# Altium schematic sheet StepperMotorBoard.SchDoc
size A3
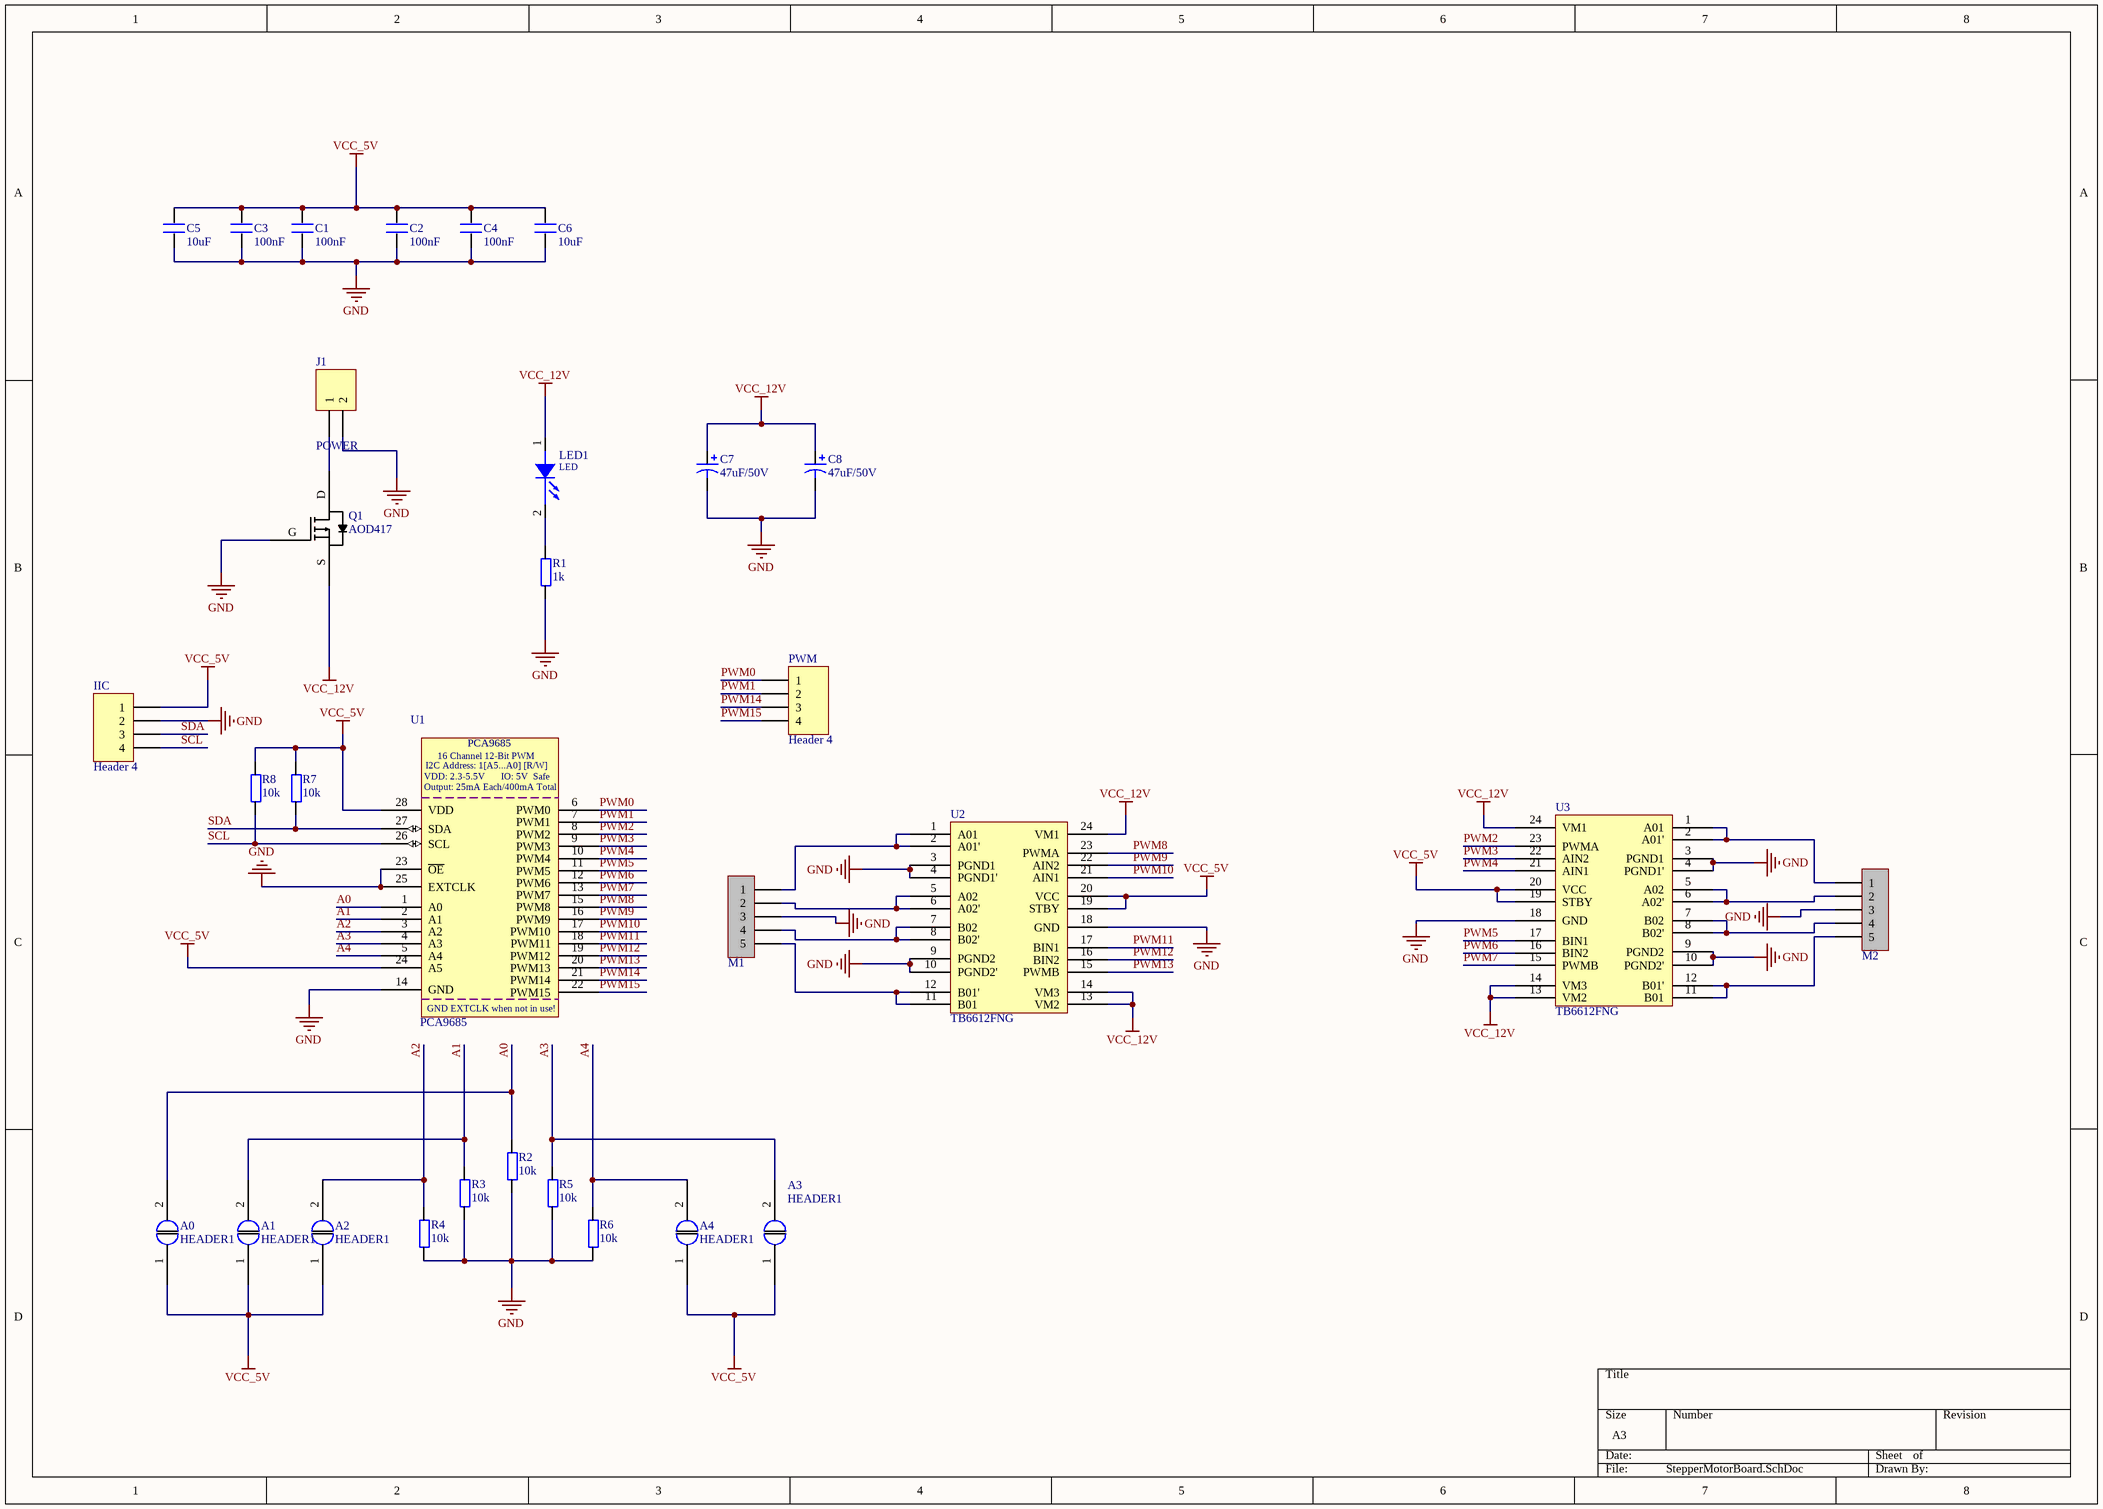
[diagram p0: StepperMotorBoard.SchDoc]

## Parts
A0  HEADER1  [HEADER1]
A1  HEADER1  [HEADER1]
A2  HEADER1  [HEADER1]
A3  HEADER1  [HEADER1]
A4  HEADER1  [HEADER1]
C1  100nF  [0603]
C2  100nF  [0603]
C3  100nF  [0603]
C4  100nF  [0603]
C5  10uF  [0603]
C6  10uF  [0603]
C7  47uF/50V  [SMDEC-6MM(220MIL)]
C8  47uF/50V  [SMDEC-6MM(220MIL)]
IIC  Header 4  [2.54-4]
J1  POWER  [Terminal block ED655]
LED1  LED  [SMDLED-0603]
M1  CON5_1  [2.54-5PMR]  (value not drawn)
M2  CON5_1  [2.54-5PMR]  (value not drawn)
PWM  Header 4  [2.54-4]
Q1  AOD417  [TO-252]
R1  1k  [0603P]
R2  10k  [0603P]
R3  10k  [0603P]
R4  10k  [0603P]
R5  10k  [0603P]
R6  10k  [0603P]
R7  10k  [0603P]
R8  10k  [0603P]
U1  PCA9685  [TSOP65P640X110-28N]
U2  TB6612FNG  [SSOP65P760X160-24N]
U3  TB6612FNG  [SSOP65P760X160-24N]

## Nets
GND: C1.2 C2.2 C3.2 C4.2 C5.2 C6.2 C7.2 C8.2 IIC.2 J1.2 M1.3 M2.3 Q1.G R1.1 R2.1 R3.1 R4.1 R5.1 R6.1 U1.14(GND) U1.23(~{OE}) U1.25(EXTCLK) U2.3(PGND1) U2.4(PGND1') U2.9(PGND2) U2.10(PGND2') U2.18(GND) U3.3(PGND1) U3.4(PGND1') U3.9(PGND2) U3.10(PGND2') U3.18(GND)
VCC_5V: A0.1 A1.1 A2.1 A3.1 A4.1 C1.1 C2.1 C3.1 C4.1 C5.1 C6.1 IIC.1 R7.2 R8.2 U1.24(A5) U1.28(VDD) U2.19(STBY) U2.20(VCC) U3.19(STBY) U3.20(VCC)
VCC_12V: C7.1 C8.1 LED1.1(ANODE) Q1.S U2.13(VM2) U2.14(VM3) U2.24(VM1) U3.13(VM2) U3.14(VM3) U3.24(VM1)
A0: A0.2 R2.2 U1.1(A0)
A1: A1.2 R3.2 U1.2(A1)
A2: A2.2 R4.2 U1.3(A2)
A3: A3.2 R5.2 U1.4(A3)
A4: A4.2 R6.2 U1.5(A4)
PWM0: PWM.1 U1.6(PWM0)
PWM1: PWM.2 U1.7(PWM1)
PWM2: U1.8(PWM2) U3.23(PWMA)
PWM3: U1.9(PWM3) U3.22(AIN2)
PWM4: U1.10(PWM4) U3.21(AIN1)
PWM5: U1.11(PWM5) U3.17(BIN1)
PWM6: U1.12(PWM6) U3.16(BIN2)
PWM7: U1.13(PWM7) U3.15(PWMB)
PWM8: U1.15(PWM8) U2.23(PWMA)
PWM9: U1.16(PWM9) U2.22(AIN2)
PWM10: U1.17(PWM10) U2.21(AIN1)
PWM11: U1.18(PWM11) U2.17(BIN1)
PWM12: U1.19(PWM12) U2.16(BIN2)
PWM13: U1.20(PWM13) U2.15(PWMB)
PWM14: PWM.3 U1.21(PWM14)
PWM15: PWM.4 U1.22(PWM15)
SCL: IIC.4 R8.1 U1.26(SCL)
SDA: IIC.3 R7.1 U1.27(SDA)
NetJ1_1: J1.1 Q1.D
NetLED1_2: LED1.2(CATHODE) R1.2
NetM1_1: M1.1 U2.1(A01) U2.2(A01')
NetM1_2: M1.2 U2.5(A02) U2.6(A02')
NetM1_4: M1.4 U2.7(B02) U2.8(B02')
NetM1_5: M1.5 U2.11(B01) U2.12(B01')
NetM2_1: M2.1 U3.1(A01) U3.2(A01')
NetM2_2: M2.2 U3.5(A02) U3.6(A02')
NetM2_4: M2.4 U3.7(B02) U3.8(B02')
NetM2_5: M2.5 U3.11(B01) U3.12(B01')

## Notes on the sheet
- (in symbol PCA9685) 16 Channel 12-Bit PWM; I2C Address: 1[A5...A0] [R/W]; VDD: 2.3-5.5V; IO: 5V  Safe; Output: 25mA Each/400mA Total; GND EXTCLK when not in use!

## Library data of the parts
C1-C6 = C
C7 C8 = Cap Pol1: Polarized Capacitor (Radial); Part No.: VZH101M1CTR-0606; Brand: LELON; Serial No.: 37108; Spec: 100uF/16V-20%(Φ6.3*5.7)
IIC PWM = Header 4: Header, 4-Pin; LatestRevisionDate: 17-Jul-2002; LatestRevisionNote: Re-released for DXP Platform.; Publisher: Altium Limited
J1 = Header 2_1: TERMINAL BLOCK 2PIN 25A/300V GREEN 9.52mm PITCH 12-24AWG ROHS; Manufacturer: On Shore Technology; Manufacturer Part Numbers: ED655/2DS; LatestRevisionDate: 17-Jul-2002; LatestRevisionNote: Re-released for DXP Platform.; Publisher: Altium Limited; Name of Product: Terminal block
LED1 = LED: Right: 40; Bottom: 20
M1 M2 = CON5_1: Connector
Q1 = AOD417: P-Channel Enhancement Mode Field Effect Transistor
R1-R8 = R: 贴片电阻
U1 = PCA9685: 16-channel, 12-bit PWM Fm+ I2C-bus LED controller
U2 U3 = TB6612FNG: IC MOTOR DRIVER PAR 24SSOP